# Altium schematic sheet OBD_Connector.SchDoc
size A4; DocumentNumber: 2; SheetNumber: 1; SheetTotal: 7; PostalCode_City: PostalCode_City; Country: Country; Company: Robert BOSCH GmbH; TelefonNumber: TelefonNumber; Street: Street; Department: Department
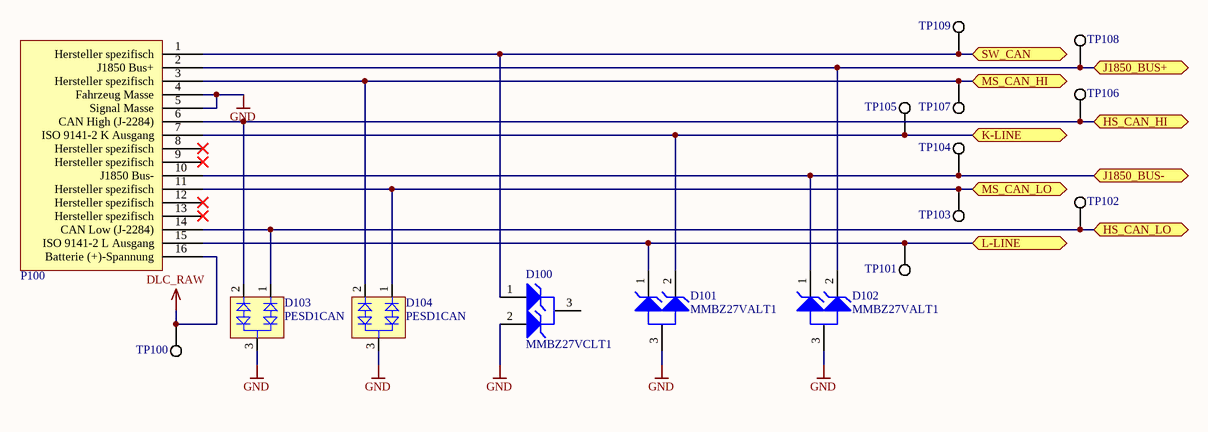
[diagram p0: OBD_Connector.SchDoc]

## Parts
D100  MMBZ27VCLT1  [ONSC-SOT-23-3-318-08_V]
D101  MMBZ27VALT1  [ONSC-SOT-23-3-318-08_V]
D102  MMBZ27VALT1  [ONSC-SOT-23-3-318-08_V]
D103  PESD1CAN  [NXP-SOT23-3_V]
D104  PESD1CAN  [NXP-SOT23-3_V]
P100  COMTECH ELECTRONIC CO., LTD ,CR-PG032  [a. OBD-Stekcer mit Winkel für Platinenmontage]  (value not drawn)
TP100  Testpad, 1.0mm x 1.0mm, round  [Testpad, 1.0mm x 1.0mm, round]  (value not drawn)  (no BOM)
TP101  Testpad, 1.0mm x 1.0mm, round  [Testpad, 1.0mm x 1.0mm, round]  (value not drawn)  (no BOM)
TP102  Testpad, 1.0mm x 1.0mm, round  [Testpad, 1.0mm x 1.0mm, round]  (value not drawn)  (no BOM)
TP103  Testpad, 1.0mm x 1.0mm, round  [Testpad, 1.0mm x 1.0mm, round]  (value not drawn)  (no BOM)
TP104  Testpad, 1.0mm x 1.0mm, round  [Testpad, 1.0mm x 1.0mm, round]  (value not drawn)  (no BOM)
TP105  Testpad, 1.0mm x 1.0mm, round  [Testpad, 1.0mm x 1.0mm, round]  (value not drawn)  (no BOM)
TP106  Testpad, 1.0mm x 1.0mm, round  [Testpad, 1.0mm x 1.0mm, round]  (value not drawn)  (no BOM)
TP107  Testpad, 1.0mm x 1.0mm, round  [Testpad, 1.0mm x 1.0mm, round]  (value not drawn)  (no BOM)
TP108  Testpad, 1.0mm x 1.0mm, round  [Testpad, 1.0mm x 1.0mm, round]  (value not drawn)  (no BOM)
TP109  Testpad, 1.0mm x 1.0mm, round  [Testpad, 1.0mm x 1.0mm, round]  (value not drawn)  (no BOM)

## Ports
HS_CAN_HI (bidir), HS_CAN_LO (bidir), J1850_BUS+ (bidir), J1850_BUS- (bidir), K-LINE (bidir), L-LINE (bidir), MS_CAN_HI (bidir), MS_CAN_LO (bidir), SW_CAN (bidir)

## Nets
DLC_RAW: P100.16(Batterie_(+)-Spannung) TP100.1
GND: D100.2(A2) D101.3(A) D102.3(A) D103.3(C) D104.3(C) P100.4(Fahrzeug_Masse) P100.5(Signal_Masse)
HS_CAN_HI: D103.2(K2) P100.6(CAN_High_(J-2284)) TP106.1 ; port HS_CAN_HI
HS_CAN_LO: D103.1(K1) P100.14(CAN_Low_(J-2284)) TP102.1 ; port HS_CAN_LO
J1850_BUS+: D102.2(K2) P100.2(J1850_Bus+) TP108.1 ; port J1850_BUS+
J1850_BUS-: D102.1(K1) P100.10(J1850_Bus-) TP104.1 ; port J1850_BUS-
K-LINE: D101.2(K2) P100.7(ISO_9141-2_K_Ausgang) TP105.1 ; port K-LINE
L-LINE: D101.1(K1) P100.15(ISO_9141-2_L_Ausgang) TP101.1 ; port L-LINE
MS_CAN_HI: D104.2(K2) P100.3(Hersteller_spezifisch) TP107.1 ; port MS_CAN_HI
MS_CAN_LO: D104.1(K1) P100.11(Hersteller_spezifisch) TP103.1 ; port MS_CAN_LO
SW_CAN: D100.1(A1) P100.1(Hersteller_spezifisch) TP109.1 ; port SW_CAN

Not connected (* = marked no-connect by the designer): D100 3(K); P100 8(Hersteller_spezifisch)* 9(Hersteller_spezifisch)* 12(Hersteller_spezifisch)* 13(Hersteller_spezifisch)*

## Notes on the sheet
- Project:
- Version:
- Revision:
- Sheet:
- /
- Document:
- File:
- Drawn by:
- VCS
- Project Folder Revision:
- SVN Revision:
- Department:
- Plot Date:
- Size:
- Plot Time:
- Release:
- A4
- © Robert Bosch GmbH 2018. All rights reserved, also regarding any disposal, exploitation, reproduction, editing, distribution, as well as in the event of applications for industrial property rights.

## Library data of the parts
D100 = CMP-1060-01000-1: 40 W Peak Power Zener Transient Voltage Suppressor, Dual Common Cathode Zeners for ESD Protection, 3-Pin SOT-23, Tape and Reel; Manufacturer: On Semiconductor; VZ Typ (V): 27; PackageDescription: 3-Pin Small Outline Transistor, Body 2.92 x 1.3 mm, Pitch 0.95 mm; ComponentLink1Description: Manufacturer URL; ComponentLink2Description: Datasheet; PartNumber: MMBZ27VCLT1; Mounting Technology: Surface Mount; ComponentLink3Description: Package Specification; PackageVersion: Rev. AP, 11/2009; ComponentLink2URL: http://www.onsemi.cn/pub_link/Collateral/MMBZ15VDLT1-D.PDF; ComponentLink3URL: http://www.onsemi.cn/pub_link/Collateral/318-08.PDF; Packing: Tape and Reel; DatasheetVersion: Rev. 12; PackageReference: SOT-23-3-318-08; ComponentLink1URL: http://www.onsemi.com/
D101 D102 = CMP-1061-00662-1: 40 W Peak Power Zener Transient Voltage Suppressor, Dual Common Anode Zeners for ESD Protection, 3-Pin SOT-23, Tape and Reel; Manufacturer: On Semiconductor; Direction: Unidirectional; IR Max (uA): 0.05; V(BR) Typ (V): 27; PPK Max (W): 40; ComponentLink1Description: Manufacturer URL; PackageDescription: 3-Pin Small Outline Transistor, Body 2.92 x 1.3 mm, Pitch 0.95 mm; Mounting Technology: Surface Mount; ComponentLink1URL: http://www.onsemi.com/; ComponentLink3Description: Package Specification; ComponentLink2URL: http://www.onsemi.com/pub_link/Collateral/MMBZ5V6ALT1-D.PDF; ComponentLink2Description: Datasheet; DatasheetVersion: Rev. 13; PartNumber: MMBZ27VALT1; PackageReference: SOT-23-3-318-08; Packing: Tape and Reel; PackageVersion: Rev. AP, 11/2009; ComponentLink3URL: http://www.onsemi.cn/pub_link/Collateral/318-08.PDF
D103 D104 = CMP-2000-04916-1: CAN Bus ESD Protection Diode, 200 W, 24 V, -65 to 150 degC, 3-Pin SOT23, RoHS, Tape and Reel; Manufacturer: NXP Semiconductors; SVHC: NoSVHC(20-Jun-2013); Reverse Stand-Off Voltage Vrwm: 24V; Breakdown Voltage Max: 30.3V; Capacitance Cd @ Vr Typ: 11pF; TVS Polarity: Bidirectional; Peak Pulse Power: 200W; Breakdown Voltage Min: 25.4V; Clamping Voltage @ 8/20µs Max: 70V; Peak Pulse Current Ippm: 3A; SMD Marking: AN; Diode Case Style: SOT-23; Breakdown Voltage: 27.8V; Breakdown Voltage Range: 25.4Vto30.3V; Capacitance Cd @ Vr Max: 17pF; No. of Pins: 3; Diode Type: BidirectionalTVS; Termination Type: SMD; Operating Temperature Max: 150degC; Datasheet URL: https://datasheet.ciiva.com/22692/109497-22692467.pdf; Package / Case: SOT-23; Diode Configuration: Bidirectional; Operating Temperature Min: -65degC; Stand-off Voltage: 24V; Datasheet Version: Rev. 04, 02/2008; Manufacturer URL: http://www.nxp.com/; Operating Temperature Range: -65degCto+150degC; Breakover Voltage Min: 25.4V; Clamping Voltage Vc Max: 70V
P100 = CMP-06105-10: OBD-2 Stiftblock rechtwinklig PCB Montagewinkel; Assembly: yes; Current Rating: 0A; Gender: male; Pitch Spacing: 3.9mm; Voltage Rating: 30V; ComponentLink1Description: Datasheet; ComponentLink1URL: https://www.obd2-shop.eu/product_info.php/products_id/303; Manufacturer: COMTECH ELECTRONIC CO., LTD; Manufacturer Part Number: CR-PG032; Mounting Type: SMT; Number of Pins: 16; Number of Rows: 2; Operating Temperature max: 85°C; Operating Temperature min: -20°C
TP100-TP109 = CMP-04511-8: Assembly: no; Case: 1.0x1.0mm, round